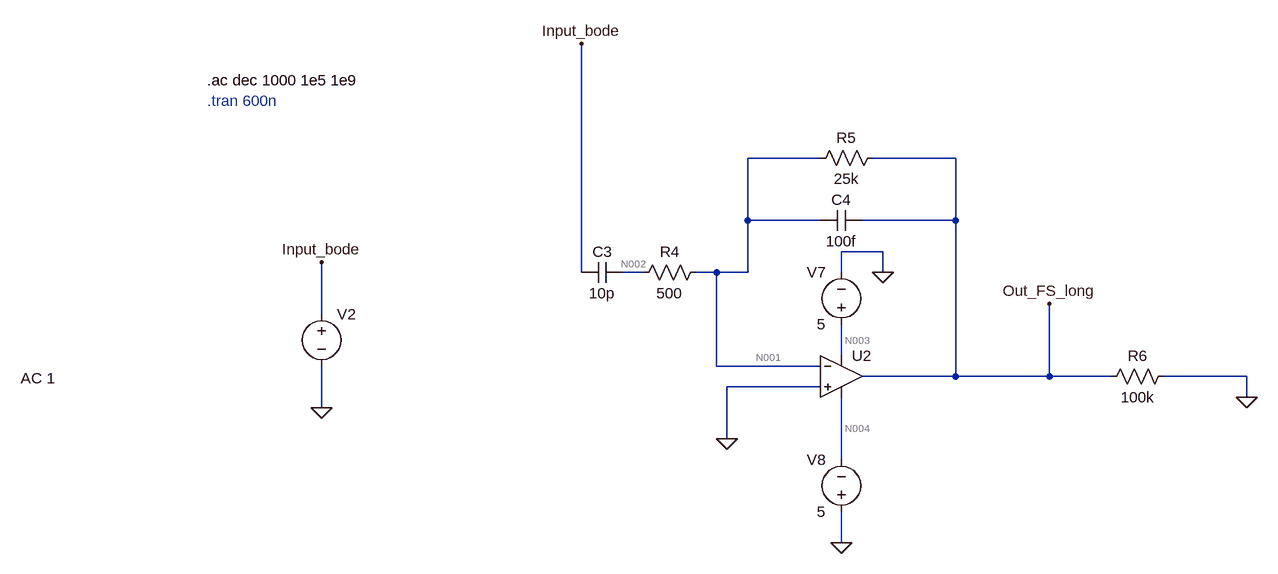
[diagram p0: schematic fast-shaper-v4_ajustadocondata.asc]
fast-shaper-v4_ajustadocondata.asc, the LTspice schematic file:
Version 4
SHEET 1 2516 1220
WIRE 416 400 304 400
WIRE 624 400 496 400
WIRE 304 496 304 400
WIRE 416 496 304 496
WIRE 624 496 624 400
WIRE 624 496 480 496
WIRE 512 544 448 544
WIRE 48 576 48 224
WIRE 144 576 112 576
WIRE 256 576 224 576
WIRE 304 576 304 496
WIRE 304 576 256 576
WIRE 448 576 448 544
WIRE 512 576 512 544
WIRE -352 640 -352 560
WIRE 448 704 448 656
WIRE 256 720 256 576
WIRE 416 720 256 720
WIRE 624 736 624 496
WIRE 624 736 480 736
WIRE 768 736 768 624
WIRE 768 736 624 736
WIRE 864 736 768 736
WIRE 1072 736 944 736
WIRE 416 752 272 752
WIRE 1072 768 1072 736
WIRE -352 784 -352 720
WIRE 272 832 272 752
WIRE 448 864 448 768
WIRE 448 992 448 944
FLAG -352 784 0
FLAG -352 560 Input_bode
FLAG 448 992 0
FLAG 512 576 0
FLAG 272 832 0
FLAG 768 624 Out_FS_long
FLAG 1072 768 0
FLAG 48 224 Input_bode
SYMBOL voltage -352 624 R0
WINDOW 3 -463 87 Left 2
WINDOW 123 -463 115 Left 2
WINDOW 39 0 0 Left 0
SYMATTR Value ""
SYMATTR Value2 AC 1
SYMATTR InstName V2
SYMBOL res 240 560 R90
WINDOW 0 0 56 VBottom 2
WINDOW 3 32 56 VTop 2
SYMATTR InstName R4
SYMATTR Value 500
SYMBOL res 512 384 R90
WINDOW 0 0 56 VBottom 2
WINDOW 3 32 56 VTop 2
SYMATTR InstName R5
SYMATTR Value 25k
SYMBOL voltage 448 672 R180
WINDOW 0 24 96 Left 2
WINDOW 3 24 16 Left 2
WINDOW 123 0 0 Left 0
WINDOW 39 0 0 Left 0
SYMATTR InstName V7
SYMATTR Value 5
SYMBOL voltage 448 960 R180
WINDOW 0 24 96 Left 2
WINDOW 3 24 16 Left 2
WINDOW 123 0 0 Left 0
WINDOW 39 0 0 Left 0
SYMATTR InstName V8
SYMATTR Value 5
SYMBOL OpAmps\\UniversalOpAmp1 448 736 R0
SYMATTR InstName U2
SYMATTR Value2 Avol=1Meg GBW=800Meg Vos=0
SYMBOL res 960 720 R90
WINDOW 0 0 56 VBottom 2
WINDOW 3 32 56 VTop 2
SYMATTR InstName R6
SYMATTR Value 100k
SYMBOL cap 112 560 R90
WINDOW 0 0 32 VBottom 2
WINDOW 3 32 32 VTop 2
SYMATTR InstName C3
SYMATTR Value 10p
SYMBOL cap 480 480 R90
WINDOW 0 0 32 VBottom 2
WINDOW 3 32 32 VTop 2
SYMATTR InstName C4
SYMATTR Value 100f
TEXT -528 312 Left 2 ;.tran 600n
TEXT -528 280 Left 2 !.ac dec 1000 1e5 1e9

The netlist it stands for:
* fast-shaper-v4_ajustadocondata.asc
V2 Input_bode 0 AC 1
R4 N001 N002 500
R5 Out_FS_long N001 25k
V7 N003 0 5
V8 0 N004 5
XU2 0 N001 N003 N004 Out_FS_long level1 Avol=1Meg GBW=800Meg Vos=0 En=0 Enk=0 In=0 Ink=0 Rin=500Meg  ; pins In+ In- V+ V- OUT
R6 0 Out_FS_long 100k
C3 N002 Input_bode 10p
C4 Out_FS_long N001 100f
* .tran 600n
.ac dec 1000 1e5 1e9
.lib UniversalOpAmp1.lib
.backanno
.end

* Results of the author's LTspice run, read from the files saved beside the schematic
* Operating Point, zero values left out:
*   V(n003) = 5 V
*   V(n004) = -5 V
*   I(V7) = -10 nA
*   I(V8) = -10 nA
*   Ix(u2:3) = 10 nA
*   Ix(u2:4) = -10 nA
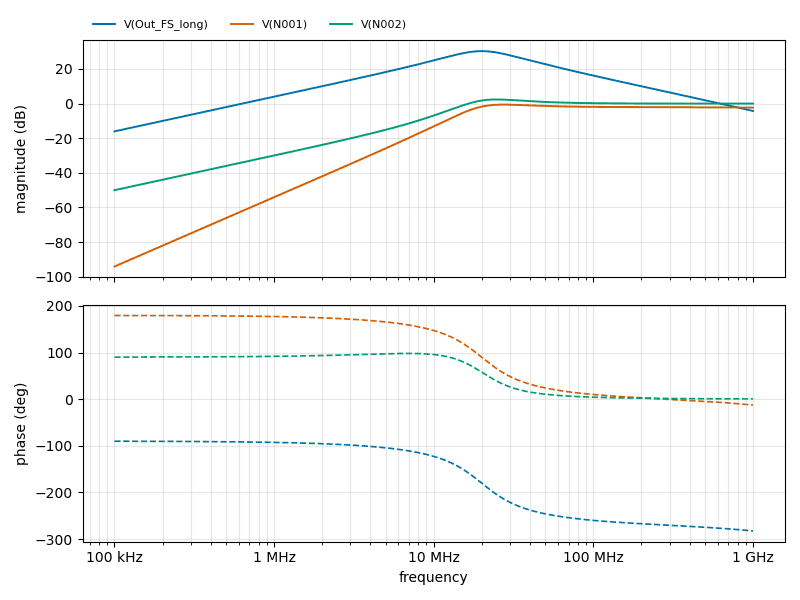
[diagram p1: AC Analysis of fast-shaper-v4_ajustadocondata.asc, plotted from the saved traces]
* AC Analysis, 1 run:
*   V(Out_FS_long): -16.08 dB at 100 kHz, -4.30 dB at 1 GHz, peak 30.27 dB at 20 MHz, 3 dB below the peak at 12.56 MHz and 31.78 MHz
*   V(N001): -94.14 dB at 100 kHz, -2.37 dB at 1 GHz, peak -0.63 dB at 27.23 MHz, 3 dB below the peak at 17.01 MHz
*   V(N002): -50.06 dB at 100 kHz, -0.05 dB at 1 GHz, peak 2.35 dB at 24.77 MHz, 3 dB below the peak at 15.67 MHz